# EAGLE design laser_buck_converter (EAGLE 6.3)
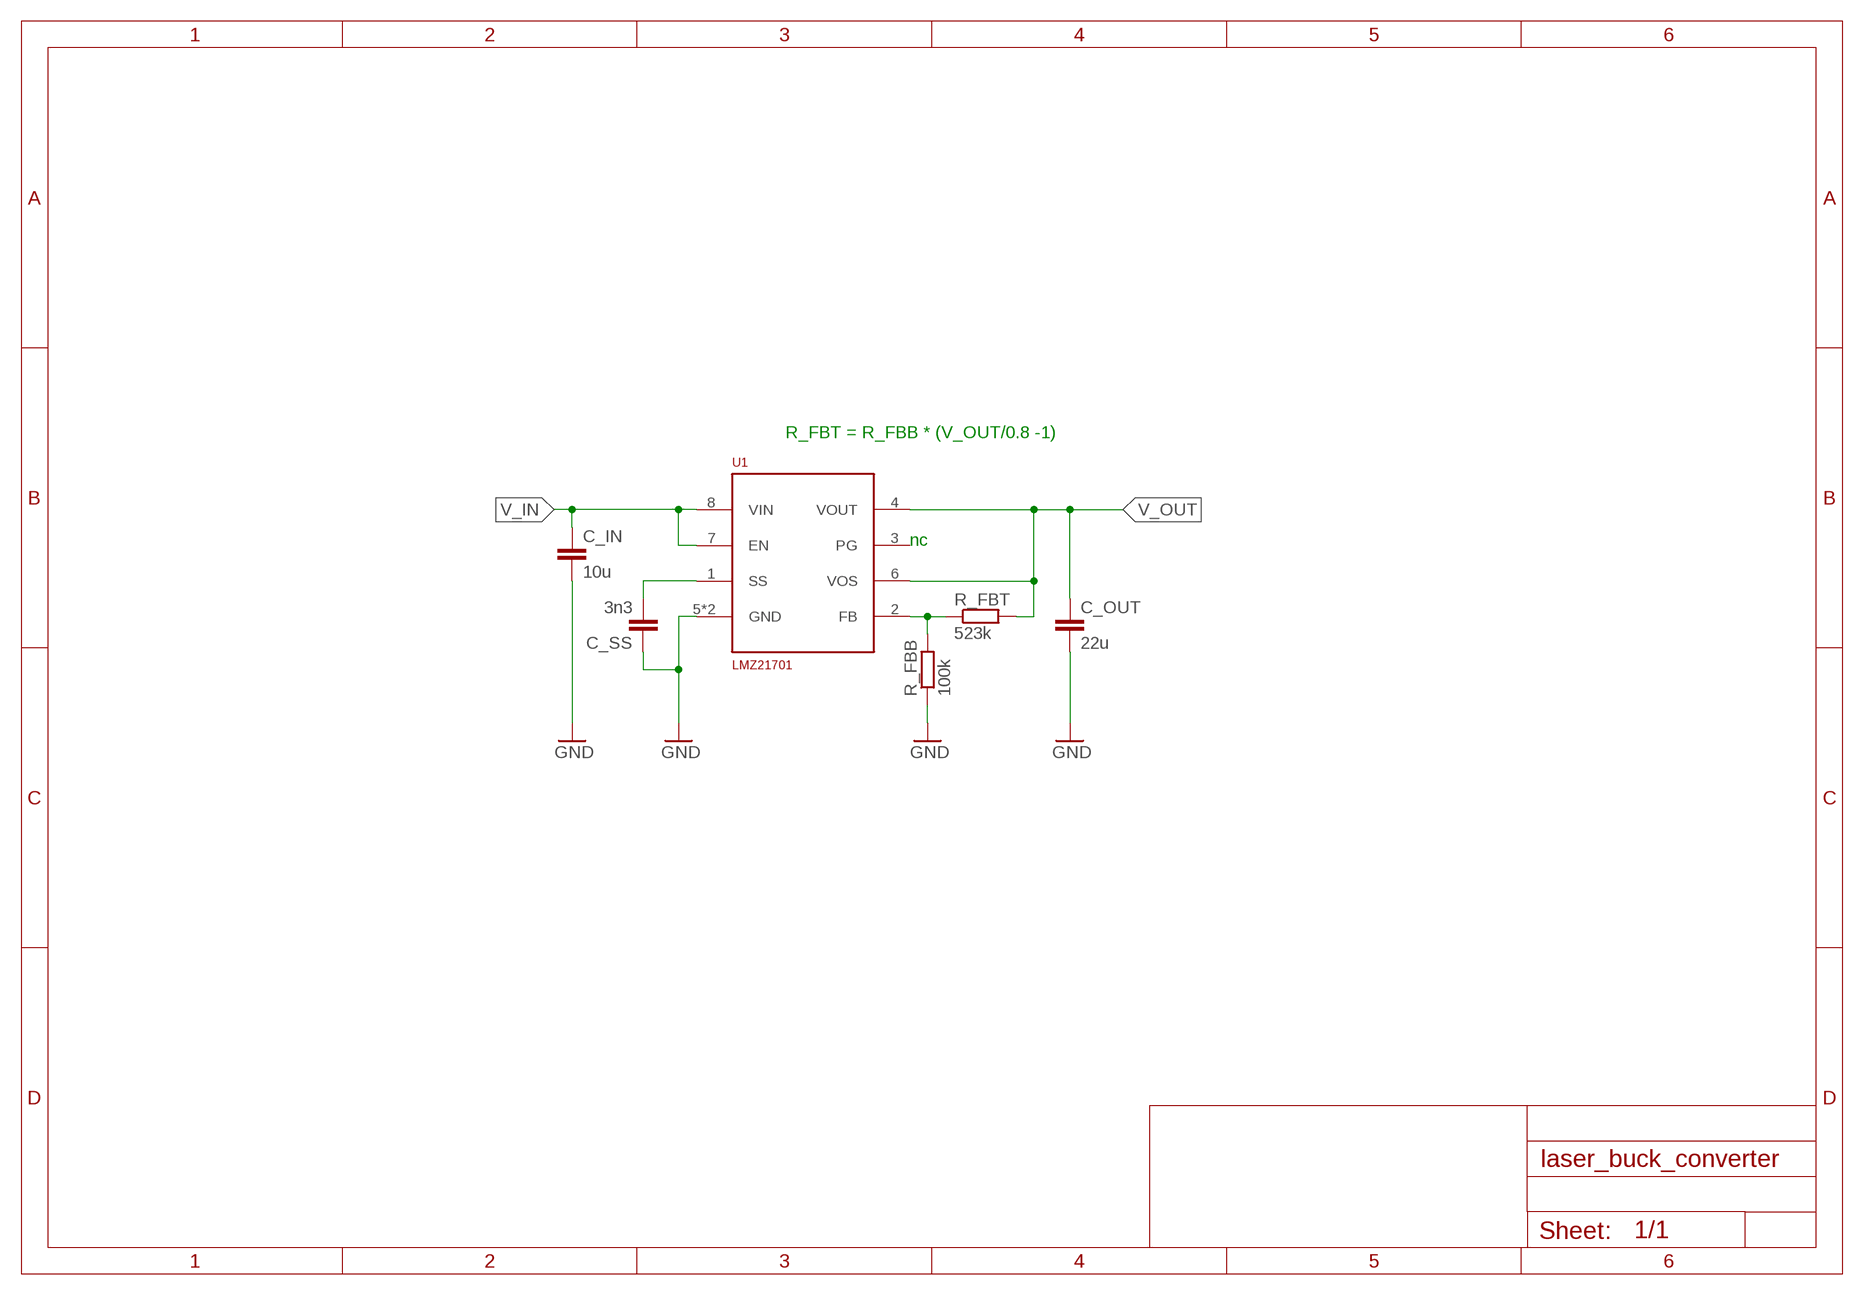
[diagram p0: schematic, sheet 1]

## Parts
C_IN  10u  C-EUC0603  [C0603]
C_OUT  22u  C-EUC0603  [C0603]
C_SS  3n3  C-EUC0402  [C0402]
R_FBB  100k  R-EU_R0402  [R0402]
R_FBT  523k  R-EU_R0402  [R0402]
U1  LMZ21701  [SIL0008E]

## Nets
GND: C_IN.2 C_OUT.2 C_SS.1 R_FBB.1 U1.5(GND) U1.PAD(GND)
N$2: C_SS.2 U1.1(SS)
N$3: R_FBB.2 R_FBT.1 U1.2(FB)
V_IN: C_IN.1 U1.7(EN) U1.8(VIN)
V_OUT: C_OUT.1 R_FBT.2 U1.4(VOUT) U1.6(VOS)
Unconnected: U1.3(PG)

## Notes on the sheet
- R_FBT = R_FBB * (V_OUT/0.8 -1)
- nc

## Library data of the parts
C_IN = rcl:C-EU: CAPACITOR, European symbol; DISTRIBUTOR: Mouser; ORDER_CODE: 81-GRM188R61C106MALD
C_OUT = rcl:C-EU: CAPACITOR, European symbol; DISTRIBUTOR: Mouser; ORDER_CODE: 810-C1608X5R1A226M
C_SS = rcl:C-EU: CAPACITOR, European symbol
R_FBB = rcl:R-EU_: RESISTOR, European symbol; DISTRIBUTOR: Digikey; ORDER_CODE: P10.0KLCT-ND
R_FBT = rcl:R-EU_: RESISTOR, European symbol; DISTRIBUTOR: Digikey; ORDER_CODE: P523KLCT-ND
U1 = ti:LMZ2170*: LMZ2170X 1 A SIMPLE SWITCHER® Nano Module with 17 V Maximum Input Voltage; DISTRIBUTOR: RS; ORDER_CODE: 798-1212

## Board
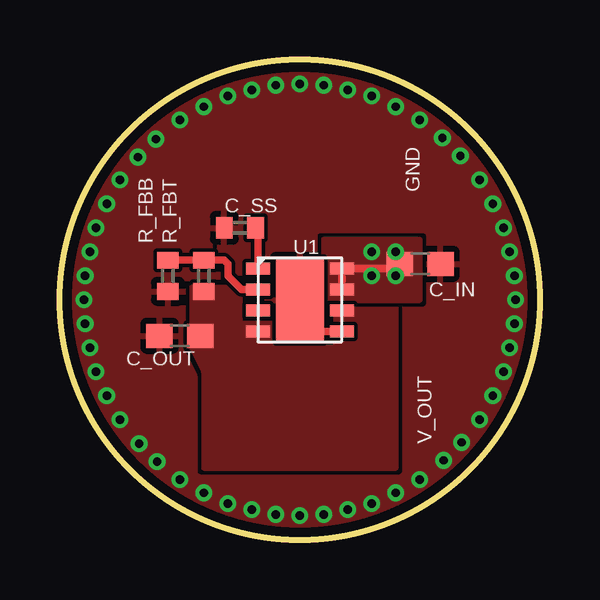
[diagram p1: board, top side]
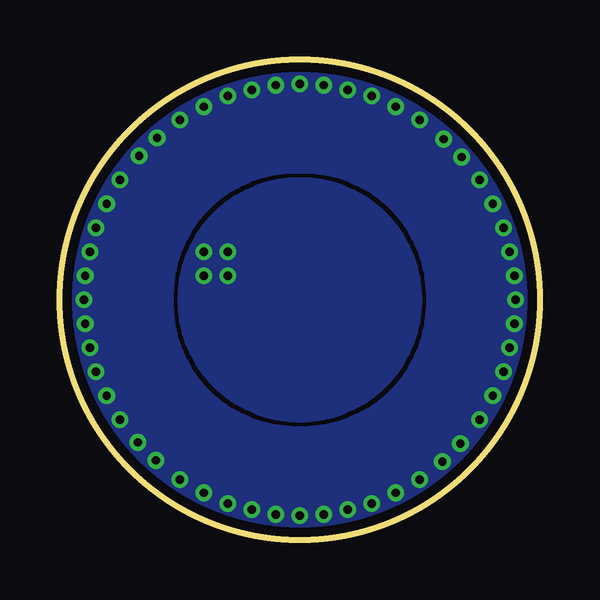
[diagram p2: board, bottom side, seen from below]

Size 20 x 20 mm. Coordinates in mm from the lower left corner, seen from the top.
Outline: circle at 10,10 radius 10
Copper layers (1*16): Top 0.0356mm / dielectric 1.5011mm / Bottom 0.0356mm
Design rules "oshPark2Layer *": minimum track width 6mil, minimum drill 13mil, track to track 6mil, track to pad 6mil, pad to pad 6mil, via to via 6mil, smd to smd 6mil, copper to edge 15mil, drill to drill 6mil, minimum pad ring 7mil, minimum via ring 7mil, stop-mask expansion 3mil, vias tented up to drill 40mil, thermal gap 10mil

### Footprints (pad centres in the part's own frame; a part is rotated, then mirrored left to right if it is on the bottom)
C0603 = smd 1.1 x 1: 1 -0.85,0; 2 0.85,0
C0402 = smd 0.7 x 0.9: 1 -0.65,0; 2 0.65,0
R0402 = smd 0.7 x 0.9: 1 -0.65,0; 2 0.65,0
SIL0008E = smd 1 x 0.5: 1 -1.75,1.312; 2 -1.75,0.438; 3 -1.75,-0.438; 4 -1.75,-1.312; 5 1.75,-1.312; 6 1.75,-0.438; 7 1.75,0.438; 8 1.75,1.312 | smd 2 x 3.5: PAD 0,0

### Placement (x,y rotation side)
C_IN  15.02,11.5 0 top
C_OUT  5,8.5 180 top
C_SS  7.5,13 0 top
R_FBB  4.5,11 90 top
R_FBT  6,11 270 top
U1  10,10 0 top

### Tracks (layer width: path | path; a pad name or v marks a point on that pad's centre or on a via)
GND  (via drill 0.35)
  Top 0.305: U1.5 10.31,8.69 10,9 U1.PAD
  other vias: 10,19 1,10 5,17.5 8,18.75 7,18.5 6,18.05 9,18.95 4,16.7 1.05,11 1.25,12 1.5,13 1.95,14 2.5,15 3.25,15.95 19,10 15,2.5 12,1.25 13,1.5 14,1.95 11,1.05 16,3.3 18.95,9 18.75,8 18.5,7 18.05,6 17.5,5 16.75,4.05 17.5,15 18.75,12 18.5,13 18.05,14 18.95,11 16.7,16 11,18.95 12,18.75 13,18.5 14,18.05 15,17.5 15.95,16.75 10,1 2.5,5 1.25,8 1.5,7 1.95,6 1.05,9 3.3,4 9,1.05 8,1.25 7,1.5 6,1.95 5,2.5 4.05,3.25
  pour Bottom (rank 3): -0.5,10 arc-90 10,20.5 arc-90 20.5,10 arc-90 10,-0.5 arc-90
  pour Top (rank 3): -1,10 arc-90 10,21 arc-90 21,10 arc-90 10,-1 arc-90
N$2
  Top 0.305: U1.1 8.25,12.9 C_SS.2
N$3
  Top 0.305: R_FBB.2 R_FBT.1 6.85,11.65 7,11.5 7,11 7.56,10.44 U1.2
V_IN  (via drill 0.35)
  Top 0.305: C_IN.1 13.98,11.31 U1.8 U1.7
  other vias: 13,11 13,12 14,12 14,11
  pour Bottom (rank 2): 5,10 arc-90 10,15 arc-90 15,10 arc-90 10,5 arc-90
  pour Top (no thermals): 15,10 15,12.5 11,12.5 11,10
V_OUT
  Top 0.305: C_OUT.1 6,8.65
  pour Top (rank 2, no thermals): 14,3 14,10 11.5,10 11.5,8 9,8 9,9 7.5,9 7.5,10.5 5.5,10.5 5.5,8 6,7 6,3

### Text on the board
tNames: GND | V_OUT